# EAGLE schematic scematics (EAGLE 9.2.2)
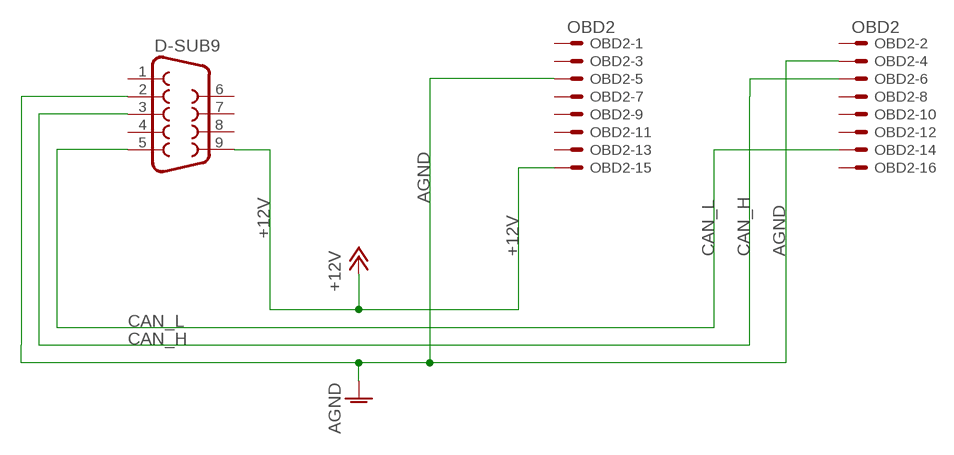
[diagram p0: schematic, sheet 1]

## Parts
D-SUB9  F09VB  [F09VB]
OBD2  OBD2  87758-1616  [87758-1616]

## Nets
+12V: D-SUB9.9 OBD2.15
AGND: D-SUB9.2 OBD2.4 OBD2.5
CAN_H: D-SUB9.3 OBD2.6
CAN_L: D-SUB9.5 OBD2.14
Unconnected: D-SUB9.1 D-SUB9.4 D-SUB9.6 D-SUB9.7 D-SUB9.8 OBD2.1 OBD2.2 OBD2.3 OBD2.7 OBD2.8 OBD2.9 OBD2.10 OBD2.11 OBD2.12 OBD2.13 OBD2.16

## Library data of the parts
D-SUB9 = con-subd:F09: SUB-D; OC_FARNELL: unknown; OC_NEWARK: unknown
OBD2 = con-molex:87758-1616: 16 Pin - 2mm Dual Row Single Wafer, Vertical T/H HDR Source: http://www.molex.com/pdm_docs/sd/877580616_sd.pdf; MF: MOLEX; MPN: 87758-1616; OC_FARNELL: 7472366; OC_NEWARK: 59J1563